# EAGLE design lm317 ic (EAGLE 9.6.2)
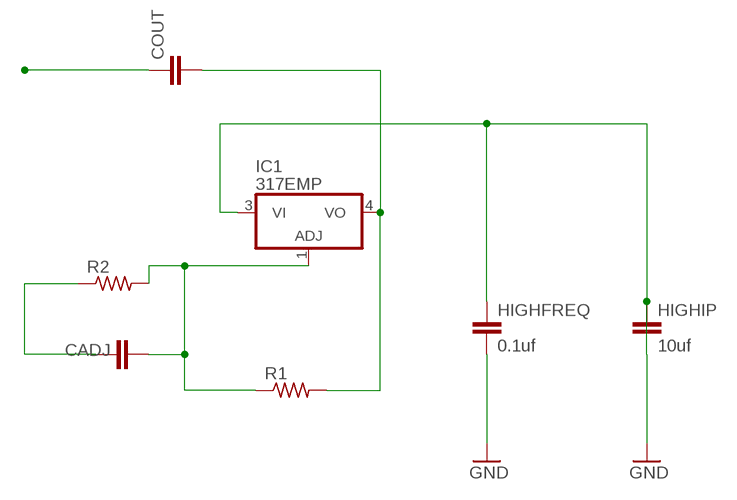
[diagram p0: schematic, sheet 1]

## Parts
CADJ  C2,5-3  [C2.5-3]
COUT  C2,5-3  [C2.5-3]
HIGHFREQ  0.1uf  C2,5-3  [C2.5-3]
HIGHIP  10uf  C2,5-3  [C2.5-3]
IC1  317EMP  [SOT223]
R1  R-US_0204/2V  [0204V]
R2  R-US_0204/2V  [0204V]

## Nets
GND: HIGHFREQ.1 HIGHFREQ.2 HIGHIP.1 HIGHIP.2 IC1.3(VI)
N$1: CADJ.2 IC1.1(ADJ) R1.1 R2.2
N$2: CADJ.1 R2.1
N$3: COUT.1
N$7: COUT.2 IC1.4(VO) R1.2

## Library data of the parts
CADJ COUT HIGHFREQ HIGHIP = capacitor-wima:C: CAPACITOR naming: grid - package width
IC1 = linear:*317: Positive VOLTAGE REGULATOR
R1 R2 = rcl:R-US_: RESISTOR, American symbol; SPICEPREFIX: R

## Board
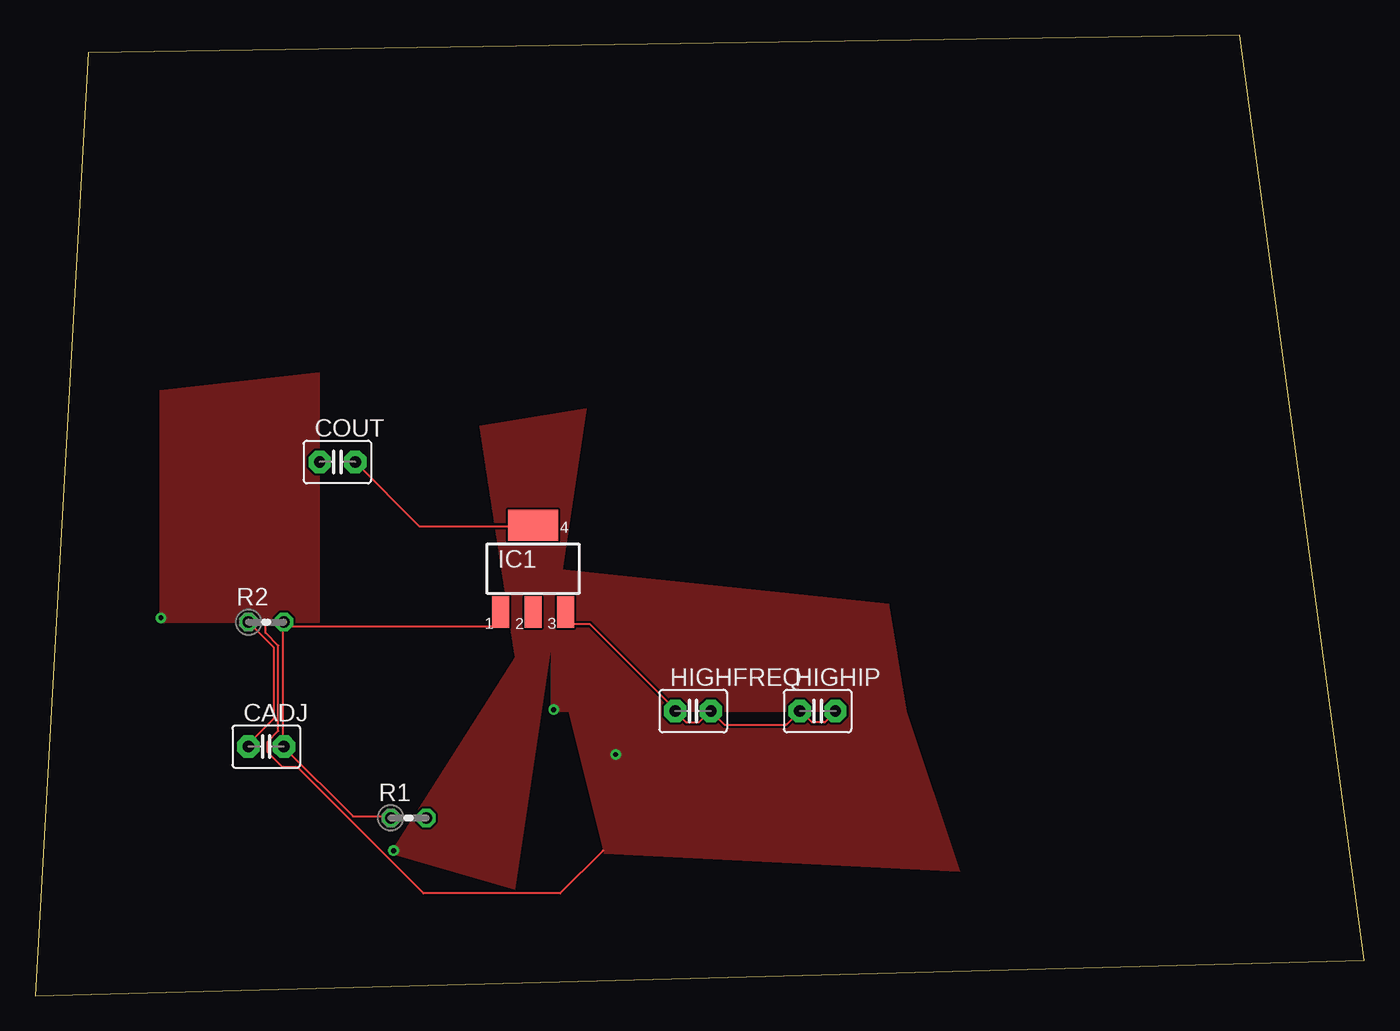
[diagram p1: board, top side]
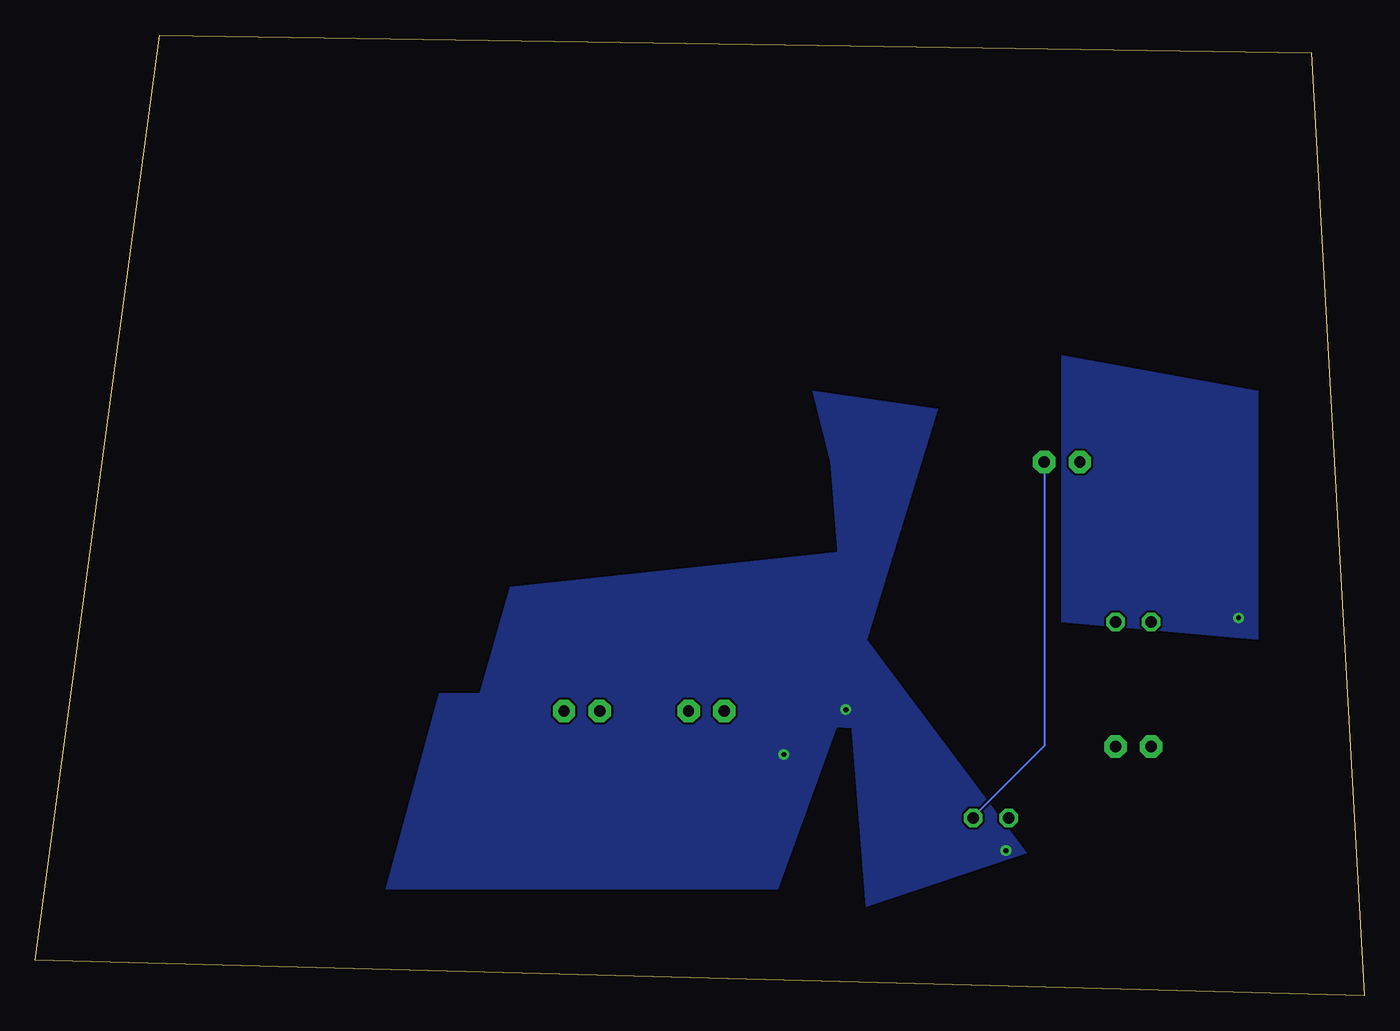
[diagram p2: board, bottom side, seen from below]

Size 94.92 x 68.57 mm. Coordinates in mm from the lower left corner, seen from the top.
Outline: 0,0 94.92,2.54 86.03,68.57 3.81,67.3 0,0
Copper layers (1*16): Top 0.035mm / dielectric 1.5mm / Bottom 0.035mm
Design rules "default": minimum track width 6mil, minimum drill 0.35mm, track to track 6mil, track to pad 6mil, pad to pad 6mil, via to via 6mil, smd to smd 6mil, copper to edge 40mil, drill to drill 6mil, minimum pad ring 10mil, minimum via ring 8mil, stop-mask expansion 4mil, vias tented up to drill 0mil, thermal gap 10mil

### Footprints (pad centres in the part's own frame; a part is rotated, then mirrored left to right if it is on the bottom)
C2.5-3 = drill 0.813 pad 1.6 octagon: 1 -1.27,0; 2 1.27,0
SOT223 = smd 1.219 x 2.235: 1 -2.311,-3.099; 2 0,-3.099; 3 2.311,-3.099 | smd 3.6 x 2.2: 4 0,3.099
0204V = drill 0.813 octagon: 1 -1.27,0; 2 1.27,0

### Placement (x,y rotation side)
CADJ  16.51,17.78 0 top
COUT  21.59,38.1 0 top
HIGHFREQ  46.99,20.32 0 top
HIGHIP  55.88,20.32 0 top
IC1  35.56,30.48 0 top
R1  26.67,12.7 0 top
R2  16.51,26.67 0 top

### Tracks (layer width: path | path; a pad name or v marks a point on that pad's centre or on a via)
GND
  Top 0.152: HIGHIP.2 57.15,20.27 56.39,19.51 55.47,19.51 54.71,20.27 HIGHIP.1 53.65,19.36 49.23,19.36 HIGHFREQ.2 48.16,20.27 47.4,19.51 46.48,19.51 45.72,20.27 HIGHFREQ.1 45.72,20.42 39.62,26.52 37.95,26.52 37.95,27.28 IC1.3
GROUND  (via drill 0.35)
  Top 0.152: 16.46,26.67 16.46,25.91 17.37,24.99 17.37,18.9 16.61,18.14 16.61,17.37 17.68,16.31 18.75,16.31 27.74,7.32 37.49,7.32 40.54,10.36 40.59,10.38
  other vias: 8.99,26.97 41.45,17.22
  pour Top: 8.89,43.18 8.89,26.67 20.32,26.67 20.32,44.45
  pour Bottom: 7.62,43.18 7.62,25.4 21.59,26.67 21.59,45.72
  pour Top: 60.96,20.32 38.1,20.32 40.64,10.16 66.04,8.89 62.23,20.32
  pour Bottom: 60.96,21.59 36.83,21.59 41.91,7.62 69.85,7.62 66.04,21.59
N$1
  Top 0.152: R1.1 25.3,12.8 22.71,12.8 17.83,17.68 CADJ.2 17.68,17.83 17.68,26.67 R2.2 17.83,26.67 18.14,26.36 33.07,26.36 33.22,26.52 33.22,27.28 IC1.1
N$2
  Top 0.152: R2.1 17.07,24.84 17.07,19.81 15.24,17.98 CADJ.1
N$7
  Top 0.152: COUT.2 27.43,33.53 35.51,33.53 IC1.4
  Bottom 0.152: COUT.2 22.86,17.83 27.89,12.8 R1.2
OUTPUT  (via drill 0.35)
  other vias: 25.6,10.36
  pour Top: 39.37,41.91 31.75,40.64 34.29,24.13 25.4,10.16 34.29,7.62
  pour Bottom: 39.37,43.18 30.48,41.91 35.56,25.4 24.13,10.16 35.56,6.35 38.1,38.1
POWER  (via drill 0.35)
  other vias: 37.03,20.42
  pour Top: 60.96,27.94 36.83,30.48 36.83,20.32 62.23,20.32
  pour Bottom: 60.96,29.21 36.83,31.75 35.56,19.05 63.5,20.32